# EAGLE design v3-half (EAGLE 8.4.1)
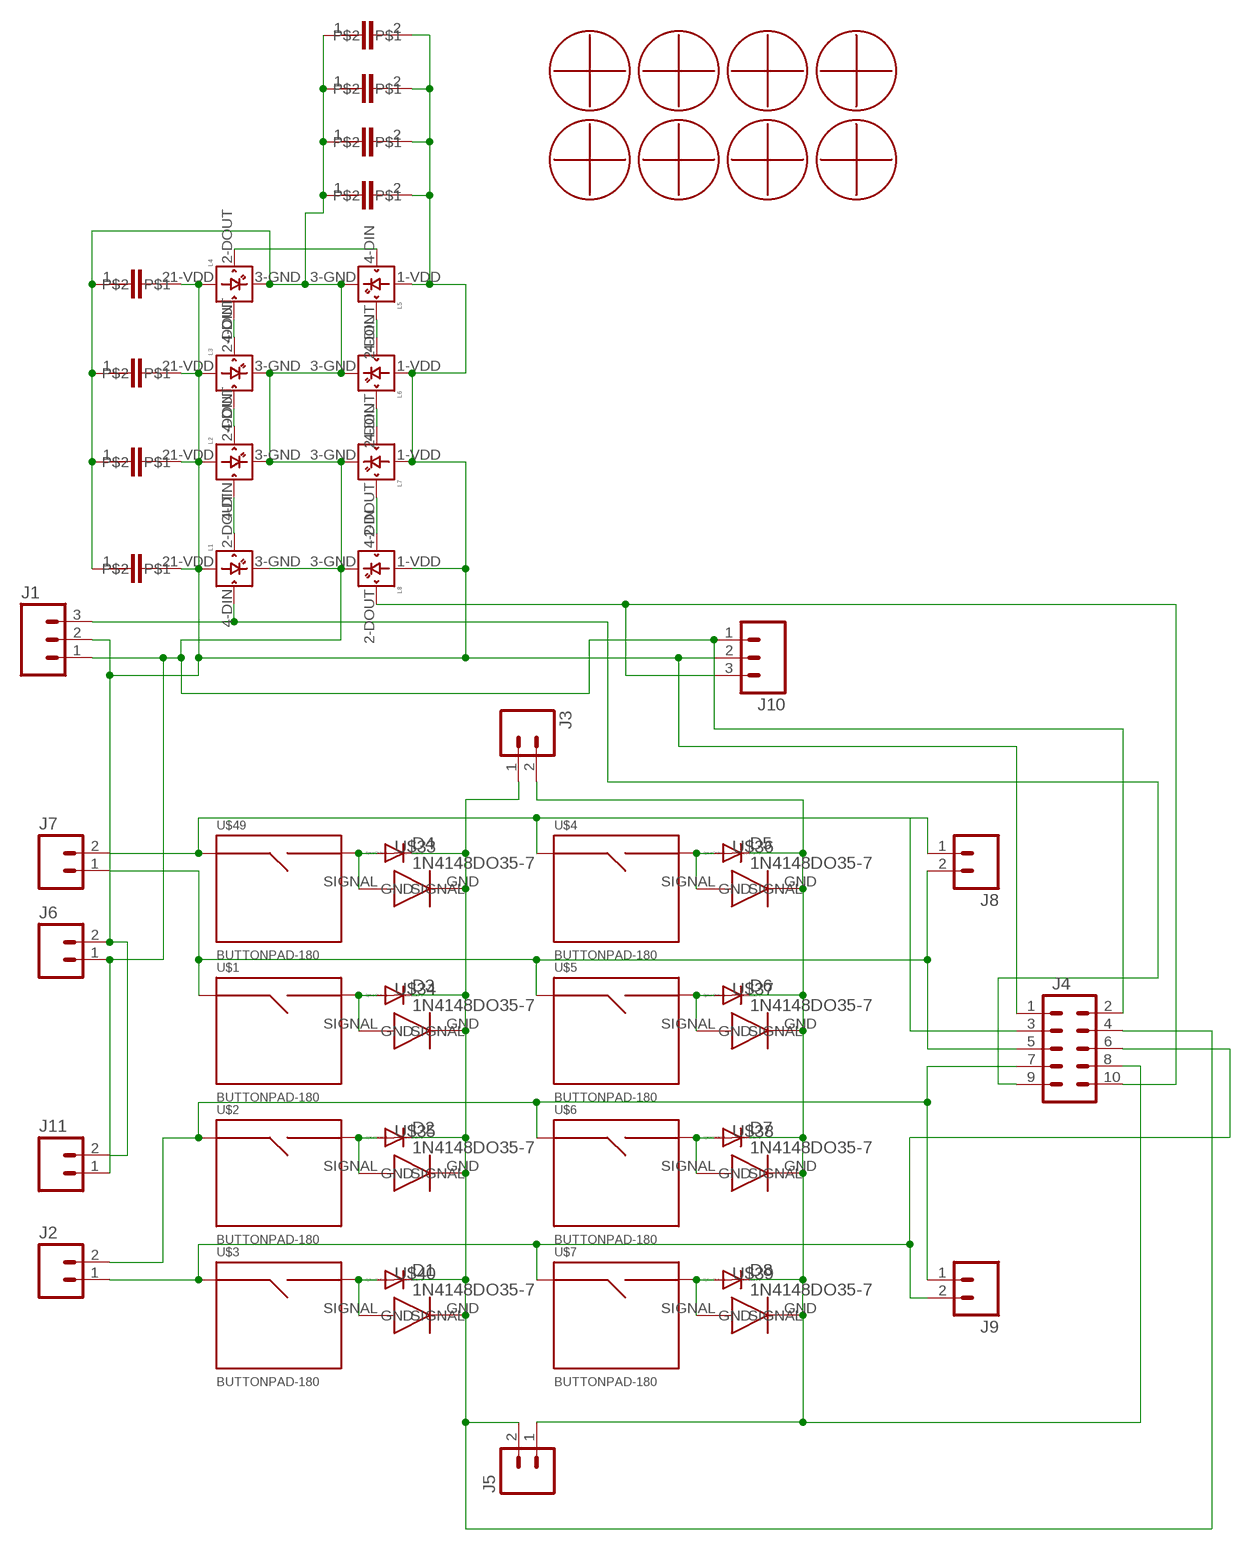
[diagram p0: schematic, sheet 1]

## Parts
D1  1N4148DO35-7  [DO35-7]
D2  1N4148DO35-7  [DO35-7]
D3  1N4148DO35-7  [DO35-7]
D4  1N4148DO35-7  [DO35-7]
D5  1N4148DO35-7  [DO35-7]
D6  1N4148DO35-7  [DO35-7]
D7  1N4148DO35-7  [DO35-7]
D8  1N4148DO35-7  [DO35-7]
J1  M031X03_NO_SILK  [1X03_NO_SILK]
J2  M021X02_NO_SILK  [1X02_NO_SILK]
J3  M021X02_NO_SILK  [1X02_NO_SILK]
J4  M05X2NO_SILK  [2X5_NOSILK]
J5  M021X02_NO_SILK  [1X02_NO_SILK]
J6  M021X02_NO_SILK  [1X02_NO_SILK]
J7  M021X02_NO_SILK  [1X02_NO_SILK]
J8  M021X02_NO_SILK  [1X02_NO_SILK]
J9  M021X02_NO_SILK  [1X02_NO_SILK]
J10  M031X03_NO_SILK  [1X03_NO_SILK]
J11  M021X02_NO_SILK  [1X02_NO_SILK]
L1  WS2812B  [WS2812B]
L2  WS2812B  [WS2812B]
L3  WS2812B  [WS2812B]
L4  WS2812B  [WS2812B]
L5  WS2812B  [WS2812B]
L6  WS2812B  [WS2812B]
L7  WS2812B  [WS2812B]
L8  WS2812B  [WS2812B]
U$1  BUTTONPAD-180  [BUTTONPAD-180]
U$2  BUTTONPAD-180  [BUTTONPAD-180]
U$3  BUTTONPAD-180  [BUTTONPAD-180]
U$4  BUTTONPAD-180  [BUTTONPAD-180]
U$5  BUTTONPAD-180  [BUTTONPAD-180]
U$6  BUTTONPAD-180  [BUTTONPAD-180]
U$7  BUTTONPAD-180  [BUTTONPAD-180]
U$8  M25MOUNT  [M25MOUNT]
U$9  M25MOUNT  [M25MOUNT]
U$10  M25MOUNT  [M25MOUNT]
U$11  M25MOUNT  [M25MOUNT]
U$12  M25MOUNT  [M25MOUNT]
U$13  M25MOUNT  [M25MOUNT]
U$14  M25MOUNT  [M25MOUNT]
U$15  M25MOUNT  [M25MOUNT]
U$17  0805CAP  [0805]
U$18  0805CAP  [0805]
U$19  0805CAP  [0805]
U$20  0805CAP  [0805]
U$25  0805CAP  [0805]
U$26  0805CAP  [0805]
U$27  0805CAP  [0805]
U$28  0805CAP  [0805]
U$33  4148DIODE  [SOD-323]
U$34  4148DIODE  [SOD-323]
U$35  4148DIODE  [SOD-323]
U$36  4148DIODE  [SOD-323]
U$37  4148DIODE  [SOD-323]
U$38  4148DIODE  [SOD-323]
U$39  4148DIODE  [SOD-323]
U$40  4148DIODE  [SOD-323]
U$49  BUTTONPAD-180  [BUTTONPAD-180]

## Nets
A: J2.1 J4.6 J9.2 U$3.P$1(SIG1) U$7.P$1(SIG1)
B: J2.2 J4.7 J9.1 U$2.P$1(SIG1) U$6.P$1(SIG1)
C: J4.5 J7.1 J8.2 U$1.P$1(SIG1) U$5.P$1(SIG1)
C1: D1.C D2.C D3.C D4.C J3.1 J4.4 J5.2 U$33.GND U$34.GND U$35.GND U$40.GND
C2: D5.C D6.C D7.C D8.C J3.2 J4.8 J5.1 U$36.GND U$37.GND U$38.GND U$39.GND
D: J4.3 J7.2 J8.1 U$4.P$1(SIG1) U$49.P$1(SIG1)
DIN: J1.3 J4.9 L1.4-DIN(DIN)
DOUT: J4.10 J10.3 L8.2-DOUT(DOUT)
GND: J1.1 J4.2 J6.1 J10.1 J11.1 L1.3-GND(GND) L2.3-GND(GND) L3.3-GND(GND) L4.3-GND(GND) L5.3-GND(GND) L6.3-GND(GND) L7.3-GND(GND) L8.3-GND(GND) U$17.1 U$18.1 U$19.1 U$20.1 U$25.1 U$26.1 U$27.1 U$28.1
N$2: D8.A U$7.P$2(SIG2) U$39.SIGNAL
N$4: D7.A U$6.P$2(SIG2) U$38.SIGNAL
N$9: D4.A U$33.SIGNAL U$49.P$2(SIG2)
N$10: D3.A U$1.P$2(SIG2) U$34.SIGNAL
N$11: D2.A U$2.P$2(SIG2) U$35.SIGNAL
N$12: D1.A U$3.P$2(SIG2) U$40.SIGNAL
N$13: D6.A U$5.P$2(SIG2) U$37.SIGNAL
N$14: D5.A U$4.P$2(SIG2) U$36.SIGNAL
N$25: L1.2-DOUT(DOUT) L2.4-DIN(DIN)
N$26: L2.2-DOUT(DOUT) L3.4-DIN(DIN)
N$27: L3.2-DOUT(DOUT) L4.4-DIN(DIN)
N$28: L4.2-DOUT(DOUT) L5.4-DIN(DIN)
N$29: L5.2-DOUT(DOUT) L6.4-DIN(DIN)
N$30: L6.2-DOUT(DOUT) L7.4-DIN(DIN)
N$31: L7.2-DOUT(DOUT) L8.4-DIN(DIN)
VCC: J1.2 J4.1 J6.2 J10.2 J11.2 L1.1-VDD(VDD) L2.1-VDD(VDD) L3.1-VDD(VDD) L4.1-VDD(VDD) L5.1-VDD(VDD) L6.1-VDD(VDD) L7.1-VDD(VDD) L8.1-VDD(VDD) U$17.2 U$18.2 U$19.2 U$20.2 U$25.2 U$26.2 U$27.2 U$28.2

## Library data of the parts
D1-D8 = diode:1N4148: DIODE high speed (Philips)
J1 J10 = SparkFun-Connectors:M03: Header 3 Standard 3-pin 0.1" header. Use with straight break away headers (SKU : PRT-00116), right angle break away headers (PRT-00553), swiss pins (PRT-00743), machine pins (PRT-00117), and female headers (PRT-00115). Molex polarized connector foot print use with SKU : PRT-08232 with associated crimp pins and housings.
J2 J3 J5-J9 J11 = SparkFun-Connectors:M02: Standard 2-pin 0.1" header. Use with - straight break away headers ( PRT-00116) - right angle break away headers (PRT-00553) - swiss pins (PRT-00743) - machine pins (PRT-00117) - female headers (PRT-00115) Molex polarized connector foot print use with: PRT-08233 with associated crimp pins and housings. 2.54_SCREWTERM for use with PRT-10571. 3.5mm Screw Terminal footprints for PRT-08084 5mm Screw Terminal footprints for use with PRT-08432
J4 = SparkFun-Connectors:M05X2: Header 5x2 Standard 10-pin dual row 0.1" header. Commonly used with AVR-ISP. Use with Spark Fun Electronics SKU: PRT-00778
L1-L8 = GardnerTech:WS2812B
U$1-U$7 U$49 = GardnerCustom:BUTTONPAD-180
U$8-U$15 = GardnerCustom:M25MOUNT
U$17-U$20 U$25-U$28 = GardnerCustom:0805CAP
U$33-U$40 = GardnerCustom:4148DIODE

## Board
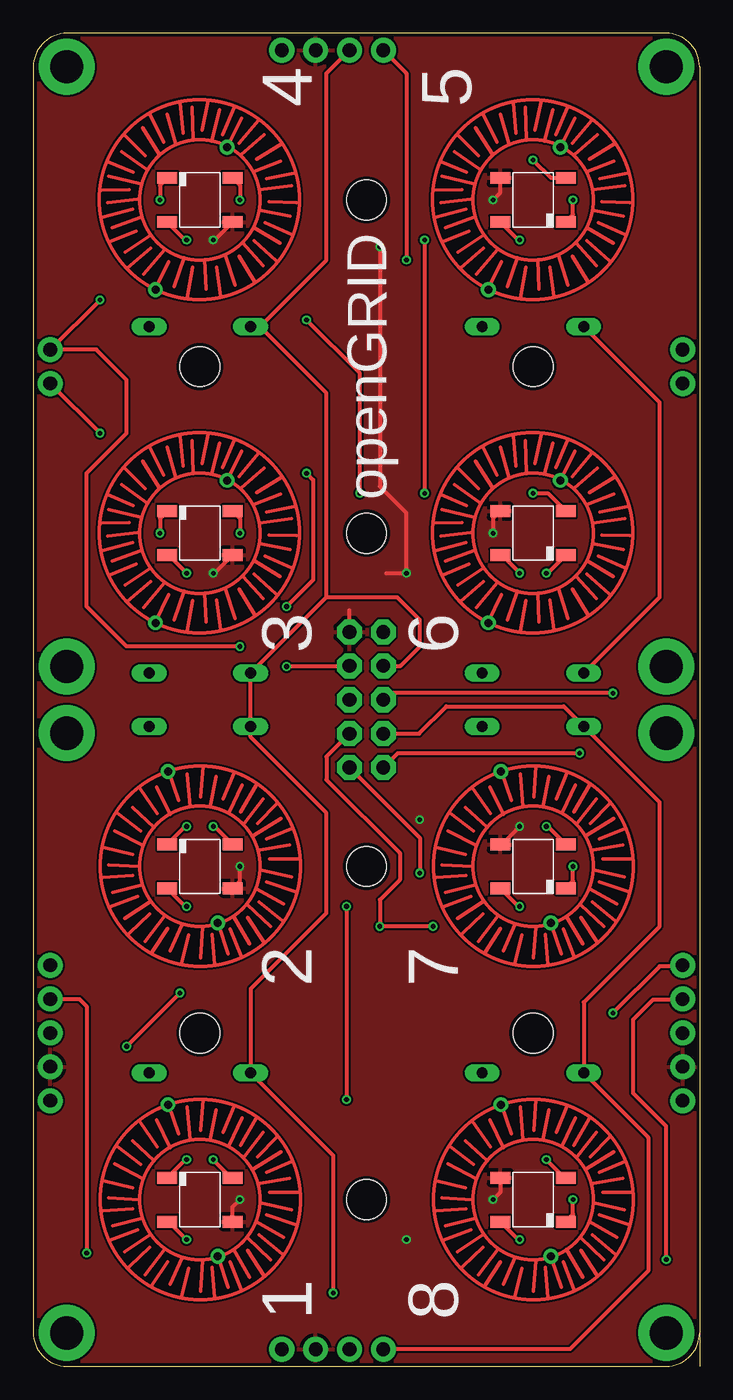
[diagram p1: board, top side]
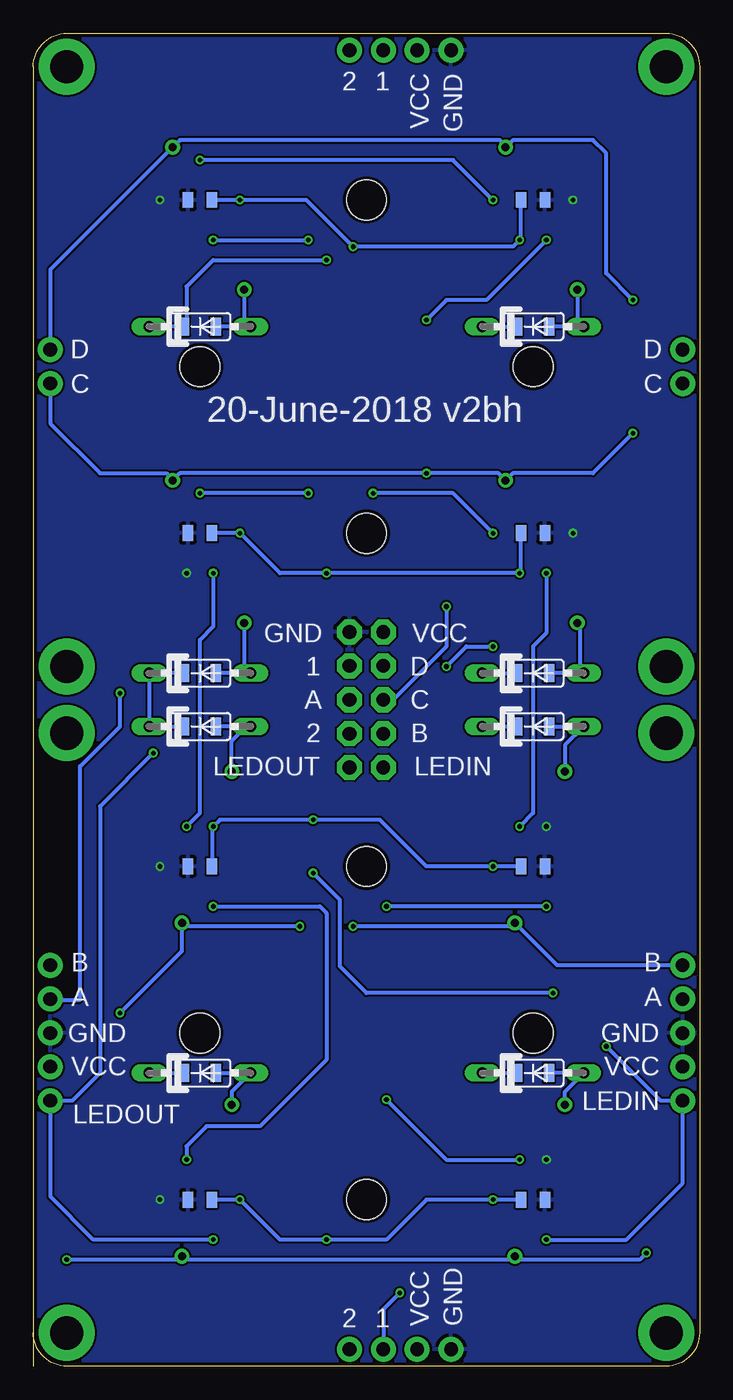
[diagram p2: board, bottom side, seen from below]

Size 50 x 100 mm. Coordinates in mm from the lower left corner, seen from the top.
Outline: 50,2.5 50,97.5 arc90 47.5,100 2.5,100 arc90 0,97.5 0,2.5 arc90 2.5,0 47.5,0 arc90 50,2.5
Outline: 50,2.5 50,0
Copper layers (1*16): Top 0.035mm / dielectric 1.5mm / Bottom 0.035mm
Design rules "SeeedStudio_2layer_DRU_no_angle_20140221 *": minimum track width 6mil, minimum drill 12mil, track to track 6mil, track to pad 6mil, pad to pad 6mil, via to via 6mil, smd to smd 0mil, copper to edge 10mil, drill to drill 10mil, minimum pad ring 10mil, minimum via ring 6mil, stop-mask expansion 2mil, vias tented up to drill 100mil, thermal gap 10mil
Holes 3 mm at 12.5,25 25,37.5 25,12.5 37.5,25 25,87.5 25,62.5 12.5,75 37.5,75

### Footprints (pad centres in the part's own frame; a part is rotated, then mirrored left to right if it is on the bottom)
DO35-7 = drill 0.813 long: A 3.81,0; C -3.81,0
1X03_NO_SILK = drill 1.016 pad 1.88: 1 0,0; 2 2.54,0; 3 5.08,0
1X02_NO_SILK = drill 1.016 pad 1.88: 1 0,0; 2 2.54,0
2X5_NOSILK = drill 1.016 pad 1.88 octagon: 1 -1.27,5.08; 2 1.27,5.08; 3 -1.27,2.54; 4 1.27,2.54; 5 -1.27,0; 6 1.27,0; 7 -1.27,-2.54; 8 1.27,-2.54; 9 -1.27,-5.08; 10 1.27,-5.08
WS2812B = smd 1.5 x 0.9: 1-VDD 2.45,-1.65; 2-DOUT 2.45,1.65; 3-GND -2.45,1.65; 4-DIN -2.45,-1.65
BUTTONPAD-180 = drill 0.6: P$1 4.445,-0.381; P$2 -7.493,0.508
M25MOUNT = drill 2.5 pad 4.2: P$1 0,0
0805 = smd 0.8 x 1.2: 1 -0.9,0; 2 0.9,0
SOD-323 = smd 0.8 x 1.35: GND 1.2,0; SIGNAL -1.2,0

### Placement (x,y rotation side)
D1  12.5,22 0 bottom
D2  12.5,48 0 bottom
D3  12.5,52 0 bottom
D4  12.5,78 0 bottom
D5  37.5,78 0 bottom
D6  37.5,52 0 bottom
D7  37.5,48 0 bottom
D8  37.5,22 0 bottom
J1  1.27,25 270 top
J2  1.27,27.54 90 top
J3  23.73,1.27 0 top
J4  25,50 0 top
J5  26.27,98.73 180 top
J6  18.65,1.27 0 top
J7  1.27,73.73 90 top
J8  48.73,76.27 270 top
J9  48.73,30.08 270 top
J10  48.73,25 270 top
J11  18.65,98.73 0 top
L1  12.5,12.5 0 top
L2  12.5,37.5 0 top
L3  12.5,62.5 0 top
L4  12.5,87.5 0 top
L5  37.5,87.5 180 top
L6  37.5,62.5 180 top
L7  37.5,37.5 180 top
L8  37.5,12.5 180 top
U$1  12.5,62.5 67.5 top
U$2  12.5,37.5 292.5 top
U$3  12.5,12.5 292.5 top
U$4  37.5,87.5 67.5 top
U$5  37.5,62.5 67.5 top
U$6  37.5,37.5 292.5 top
U$7  37.5,12.5 292.5 top
U$8  47.5,2.5 0 top
U$9  47.5,47.5 0 top
U$10  2.5,47.5 0 top
U$11  2.5,2.5 0 top
U$12  47.5,52.5 0 top
U$13  2.5,52.5 0 top
U$14  47.5,97.5 0 top
U$15  2.5,97.5 0 top
U$17  12.5,12.5 180 bottom
U$18  12.5,37.5 180 bottom
U$19  37.5,37.5 0 bottom
U$20  37.5,12.5 0 bottom
U$25  37.5,62.5 0 bottom
U$26  37.5,87.5 0 bottom
U$27  12.5,87.5 180 bottom
U$28  12.5,62.5 180 bottom
U$33  12.5,78 180 bottom
U$34  12.5,52 180 bottom
U$35  12.5,48 180 bottom
U$36  37.5,78 180 bottom
U$37  37.5,52 180 bottom
U$38  37.5,48 180 bottom
U$39  37.5,22 180 bottom
U$40  12.5,22 180 bottom
U$49  12.5,87.5 67.5 top

### Tracks (layer width: path | path; a pad name or v marks a point on that pad's centre or on a via)
A  (via drill 0.35)
  Top 0.305: v47.5,8 47.5,18 45,20.5 45,26 46.5,27.5 48.69,27.5 J9.2 | J2.1 3.46,27.54 4,27 v4,8.5 | v43.5,50.5 26.77,50.5 J4.6
  Bottom 0.305: v47.5,8 39.1,8 U$7.P$1 38.6,8 14.1,8 U$3.P$1 13.6,8 4.5,8 v4,8.5 | J9.2 48.69,27.5 46.5,27.5 46.5,45 43.5,48 v43.5,50.5
B  (via drill 0.35)
  Top 0.305: v30,33 v26,33 26,35 27.5,36.5 27.5,38.5 22,44 22,45.73 J4.7 | J9.1 48.65,30 47,30 v43.5,26.5
  Bottom 0.305: v26,33 14.1,33 U$2.P$1 10.68,30.08 J2.2 | v30,33 38.6,33 U$6.P$1 38.85,31.15 v43.5,26.5
C  (via drill 0.35)
  Top 0.305: J7.1 v5,70 | v19,57 21,59 21,66.5 v20.5,67
  Bottom 0.305: J8.2 48.73,70.73 45,67 40,67 39.55,66.55 U$5.P$1 39.01,67 v20.5,67 15.09,67 U$1.P$1 14.54,66.46 14,67 8,67 v5,70 | J4.5 23,50 19,54 v19,57
C1  (via drill 0.35)
  Top 0.305: 17,78 D4.C | 17,78 22,83 22,97 J5.2 | 22,57.69 D3.C D2.C 16.31,47.19 22,41.5 22,34 16.31,28.31 D1.C 22.5,15.81 v22.5,5.5 | 17,78 22,73 22,57.69 | 22,57.69 27.31,57.69 29,56 29,54 27.54,52.54 J4.4
  Bottom 0.305: D4.C U$33.GND | D3.C U$34.GND | D2.C U$35.GND | D1.C U$40.GND | v22.5,5.5 23.73,4.27 J3.1
C2  (via drill 0.35)
  Top 0.305: J5.1 28,97 v28,83 | D6.C 47,57.69 47,72.31 D5.C | J3.2 40.27,1.27 46.16,7.16 46.16,17.16 D8.C 41.31,27.31 47,33 47,42.31 D7.C 39.81,49.5 31,49.5 28.96,47.46 J4.8
  Bottom 0.305: D5.C U$36.GND 38.5,78.2 38.5,81 36.5,83 v28,83 | U$37.GND D6.C D7.C U$38.GND | D8.C U$39.GND
D  (via drill 0.35)
  Top 0.305: v5,80 J7.2 4.73,76.27 7,74 7,70 4,67 4,57 7,54 v15.5,54 | J4.3 23.69,52.5 v19,52.5
  Bottom 0.305: J8.1 48.73,82.28 U$4.P$1 39,92 15,92 14.55,91.55 U$49.P$1 14.54,91.46 14,92 8,92 7,91 7,82 v5,80 | v19,52.5 17.5,54 v15.5,54
DIN  (via drill 0.35)
  Top 0.305: L1.4-DIN 10.15,10.85 v11.5,9.5 | J4.9 29,39.65 v29,37 | v7,24 v11,28
  Bottom 0.305: v11.5,9.5 5.5,9.5 1.27,13.73 J1.3 2.92,19.92 v7,24 | v11,28 25,28 27,30 27,35 v29,37
DOUT  (via drill 0.35)
  Top 0.305: L8.2-DOUT 36.4,9.5 v36.5,9.5 | J4.10 27.35,46 v41,46
  Bottom 0.305: v36.5,9.5 45.5,9.5 48.73,12.73 J10.3 47.08,19.92 45,22 45,42 v41,46
GND  (via drill 0.35)
  Top 0.305: L4.3-GND 9.5,88.6 v9.5,87.5 | L5.3-GND 40.5,86.4 v40.5,87.5 | L3.3-GND 9.5,63.6 v9.5,62.5 | L6.3-GND 38.6,59.5 v38.5,59.5 | L7.3-GND 40.5,36.4 v40.5,37.5 | L2.3-GND 11.4,40.5 v11.5,40.5 | L1.3-GND 11.4,15.5 v11.5,15.5 | L8.3-GND 40.5,11.4 v40.5,12.5
  pour Bottom: -1,-1 51,-1 51,101 -1,101
N$2
  Bottom 0.305: U$39.SIGNAL D8.A 35.1,20.59 U$7.P$2
N$4
  Bottom 0.305: 34,48 D7.A | 34,48 U$38.SIGNAL | U$6.P$2 35.1,46.9 34,48
N$9
  Bottom 0.305: U$33.SIGNAL D4.A 9.16,78.47 U$49.P$2
N$10
  Bottom 0.305: 9,52 D3.A | 9,52 U$34.SIGNAL | U$1.P$2 9,55.61 9,52
N$11
  Bottom 0.305: U$35.SIGNAL D2.A 10.1,46.59 U$2.P$2
N$12
  Bottom 0.305: U$40.SIGNAL D1.A 10.1,20.59 U$3.P$2
N$13
  Bottom 0.305: U$37.SIGNAL D6.A 34.16,52.47 U$5.P$2
N$14
  Bottom 0.305: U$36.SIGNAL D5.A 34.16,78.47 U$4.P$2
N$25  (via drill 0.35)
  Top 0.305: L2.4-DIN 11.4,34.5 v11.5,34.5 | v23.5,34.5 v23.5,20 | v13.5,15.5 14.85,14.15 L1.2-DOUT
  Bottom 0.305: v11.5,34.5 v23.5,34.5 | v23.5,20 19,15.5 v13.5,15.5
N$26  (via drill 0.35)
  Top 0.305: L2.2-DOUT 13.6,40.5 v13.5,40.5 | v11.5,59.5 10.15,60.85 L3.4-DIN
  Bottom 0.305: v13.5,40.5 12.5,41.5 12.5,54 11.5,55 v11.5,59.5
N$27  (via drill 0.35)
  Top 0.305: L3.2-DOUT 15.5,63.6 v15.5,62.5 | v24.5,65.5 24.5,74.5 v20.5,78.5 | v11.5,84.5 11.4,84.5 L4.4-DIN
  Bottom 0.305: v15.5,62.5 18.5,65.5 v24.5,65.5 | v11.5,84.5 16,80 19,80 v20.5,78.5
N$28  (via drill 0.35)
  Top 0.305: L4.2-DOUT 15.5,88.6 v15.5,87.5 | v37.5,90.5 38.85,89.15 L5.4-DIN
  Bottom 0.305: v15.5,87.5 18.5,90.5 v37.5,90.5
N$29  (via drill 0.35)
  Top 0.305: L5.2-DOUT 36.4,84.5 v36.5,84.5 | v29.36,84.5 v29.36,65.5 | v37.5,65.5 38.6,65.5 L6.4-DIN
  Bottom 0.305: v36.5,84.5 v29.36,84.5 | v29.36,65.5 v37.5,65.5
N$30  (via drill 0.35)
  Top 0.305: L6.2-DOUT 35.15,60.85 v36.5,59.5 | L7.4-DIN 38.6,40.5 v38.5,40.5
  Bottom 0.305: v36.5,59.5 36.5,55.5 37.5,54.5 37.5,41.5 v38.5,40.5
N$31  (via drill 0.35)
  Top 0.305: L8.4-DIN 39.85,14.15 v38.5,15.5 | L7.2-DOUT 36.4,34.5 v36.5,34.5
  Bottom 0.305: v36.5,34.5 28.5,34.5 28,34 28,23 33,18 37,18 38.5,16.5 v38.5,15.5
VCC  (via drill 0.35)
  Top 0.305: L4.1-VDD 13.6,84.5 v13.5,84.5 | v34.5,87.5 35.05,88.05 L5.1-VDD | L3.1-VDD 13.6,59.5 v13.5,59.5 | L6.1-VDD 34.5,63.6 v34.5,62.5 | L2.1-VDD 15.5,36.4 v15.5,37.5 | v36.5,40.5 35.15,39.15 L7.1-VDD | v26,84 26,66 28,64 v28,59.5 26.5,59.5 | J4.1 23.73,56.73 | L1.1-VDD 14.95,11.95 v15.5,12.5 | L8.1-VDD 35.05,13.05 v34.5,12.5
  Bottom 0.305: U$27.2 13.4,84.6 v13.5,84.5 14,84 v26,84 29.5,87.5 v34.5,87.5 U$26.2 | U$28.2 13.4,59.6 v13.5,59.5 v28,59.5 31.5,59.5 v34.5,62.5 U$25.2 | U$19.2 36.6,40.4 v36.5,40.5 36,41 v29,41 24,41 20.5,37.5 v15.5,37.5 U$18.2 | U$17.2 v15.5,12.5 20.5,12.5 23.5,9.5 v28,9.5 31.5,9.5 v34.5,12.5 U$20.2
  pour Top: 0,0 50,0 50,100 0,100

### Text on the board
tPlace: 4 | 5 | openGRID | 3 | 6 | 2 | 7 | 1 | 8
bPlace: GND | VCC | 1 | 2 | D | D | C | C | 20-June-2018 v2bh | VCC | GND | D | 1 | C | A | B | 2 | LEDIN | LEDOUT | B | B | A | A | GND | GND | VCC | VCC | LEDIN | LEDOUT | 1 | 2 | GND | VCC